# EAGLE schematic Tilt-NE555-C_AAA (EAGLE 6.4)
Circuito per prelevare gli impulsi provenienti da un tilt e creare impulsi di lunghezza determinata
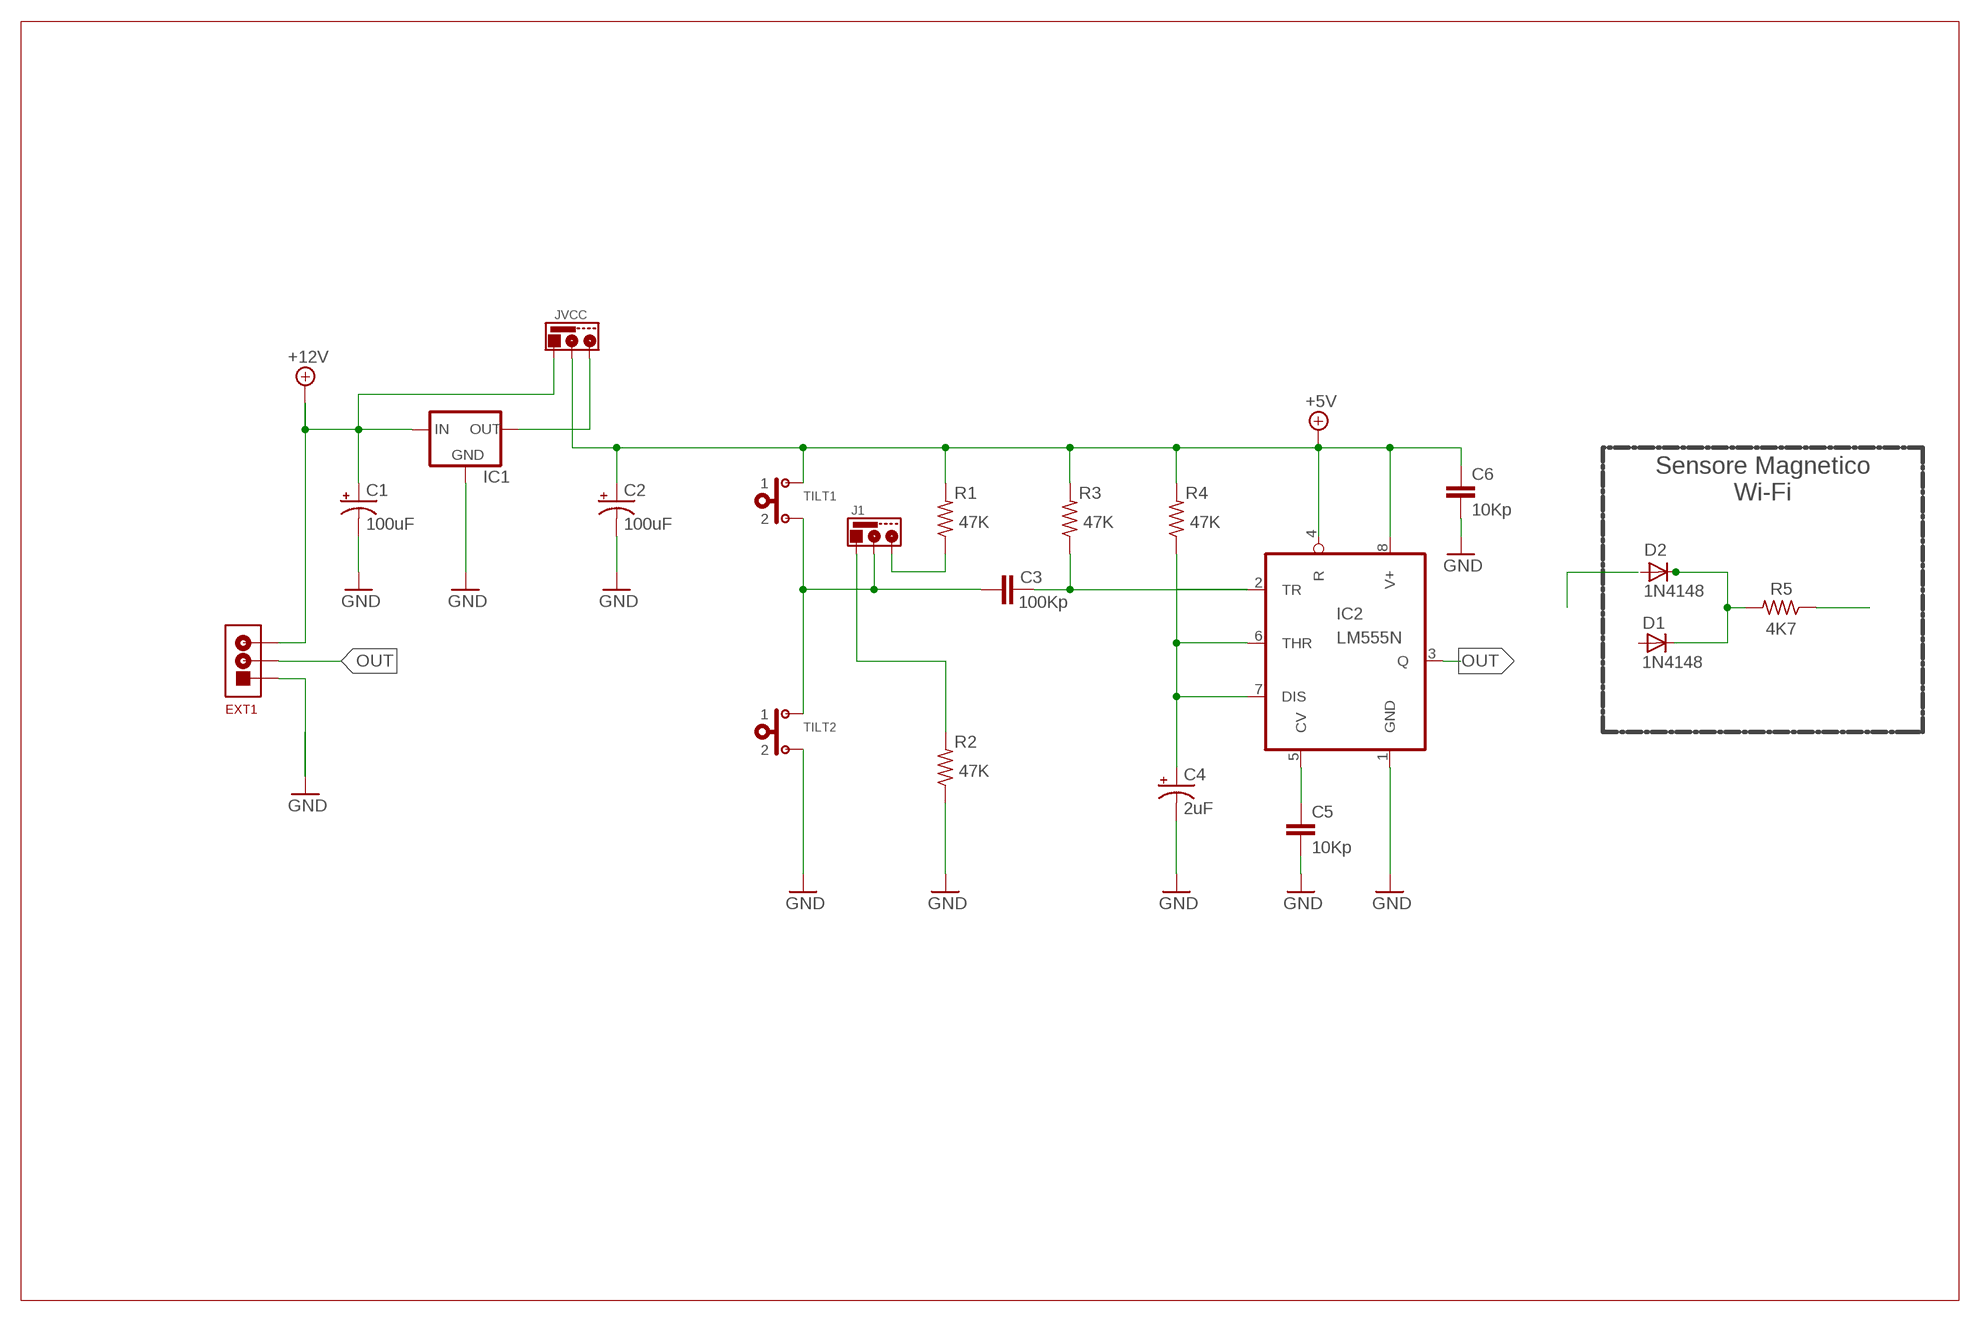
[diagram p0: schematic, sheet 1]

## Parts
C1  100uF  CPOL-USE5-5  [E5-5]
C2  100uF  CPOL-USE5-5  [E5-5]
C3  100Kp  C-EU050-035X075  [C050-035X075]
C4  2uF  CPOL-USE5-5  [E5-5]
C5  10Kp  C-EU050-045X075  [C050-045X075]
C6  10Kp  C-EU050-045X075  [C050-045X075]
D1  1N4148  1N4148DO35-10  [DO35-10]
D2  1N4148  1N4148DO35-10  [DO35-10]
EXT1  MAMMUTH03  [MAMMUTH03]
IC1  78LXX  [78LXX]
IC2  LM555N  [DIL08]
J1  JUMPER3  [SIP03]
JVCC  JUMPER3  [SIP03]
R1  47K  R-US_0207/12  [0207/12]
R2  47K  R-US_0207/12  [0207/12]
R3  47K  R-US_0207/12  [0207/12]
R4  47K  R-US_0207/12  [0207/12]
R5  4K7  R-US_0207/12  [0207/12]
TILT1  PULSANTENO  [SIP02]
TILT2  PULSANTENO  [SIP02]

## Nets
+5V: C2.+ C6.1 IC2.4(R) IC2.8(V+) JVCC.1 R1.2 R3.2 R4.2 TILT1.1
+12V: C1.+ EXT1.P$3 IC1.IN JVCC.2
GND: C1.- C2.- C4.- C5.2 C6.2 EXT1.P$1 IC1.GND IC2.1(GND) R2.1 TILT2.2
N$1: C3.2 IC2.2(TR) R3.1
N$2: C3.1 J1.1 TILT1.2 TILT2.1
N$3: C4.+ IC2.6(THR) IC2.7(DIS) R4.1
N$4: C5.1 IC2.5(CV)
N$5: J1.2 R2.2
N$6: D1.C D2.C R5.2
N$8: IC1.OUT JVCC.3
N$9: J1.3 R1.1
OUT: EXT1.P$2 IC2.3(Q)
SENSORE: R5.1
Unconnected: D1.A D2.A

## Notes on the sheet
- Sensore Magnetico
  Wi-Fi

## Library data of the parts
C1 C2 C4 = Ln-RCL:CPOL-US: POLARIZED CAPACITOR, American symbol
C3 C5 C6 = rcl:C-EU: CAPACITOR, European symbol
D1 D2 = diode:1N4148: DIODE high speed (Philips)
EXT1 = Ln-Varie:MAMMUTH03: Mammuth 03
IC1 = Ln-v-reg:78LXX: VOLTAGE REGULATOR
IC2 = Ln-linear:*555: TIMER
J1 JVCC = Ln-Varie:JUMPER3
R1-R5 = rcl:R-US_: RESISTOR, American symbol
TILT1 TILT2 = Ln-Varie:PULSANTENO: Pulsante NO